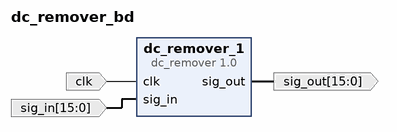
[diagram p0: block diagram of the top level]
# Vivado block design dc_remover_bd, xc7k160tfbg484-2, Vivado 2021.2
create_bd_design dc_remover_bd

create_bd_port -dir I -type clk clk
create_bd_port -dir I -from 15 -to 0 -type data sig_in
create_bd_port -dir O -from 15 -to 0 -type data sig_out

create_bd_cell -type ip -vlnv User_Company:SysGen:dc_remover:1.0 dc_remover_1

# ---- connections ----

connect_bd_net [get_bd_ports clk] [get_bd_pins dc_remover_1/clk]
connect_bd_net [get_bd_pins dc_remover_1/sig_out] [get_bd_ports sig_out]
connect_bd_net [get_bd_ports sig_in] [get_bd_pins dc_remover_1/sig_in]

validate_bd_design
save_bd_design
